# Altium schematic sheet Sheet_1_2022-11-05.schdoc
size 786 x 797 mm
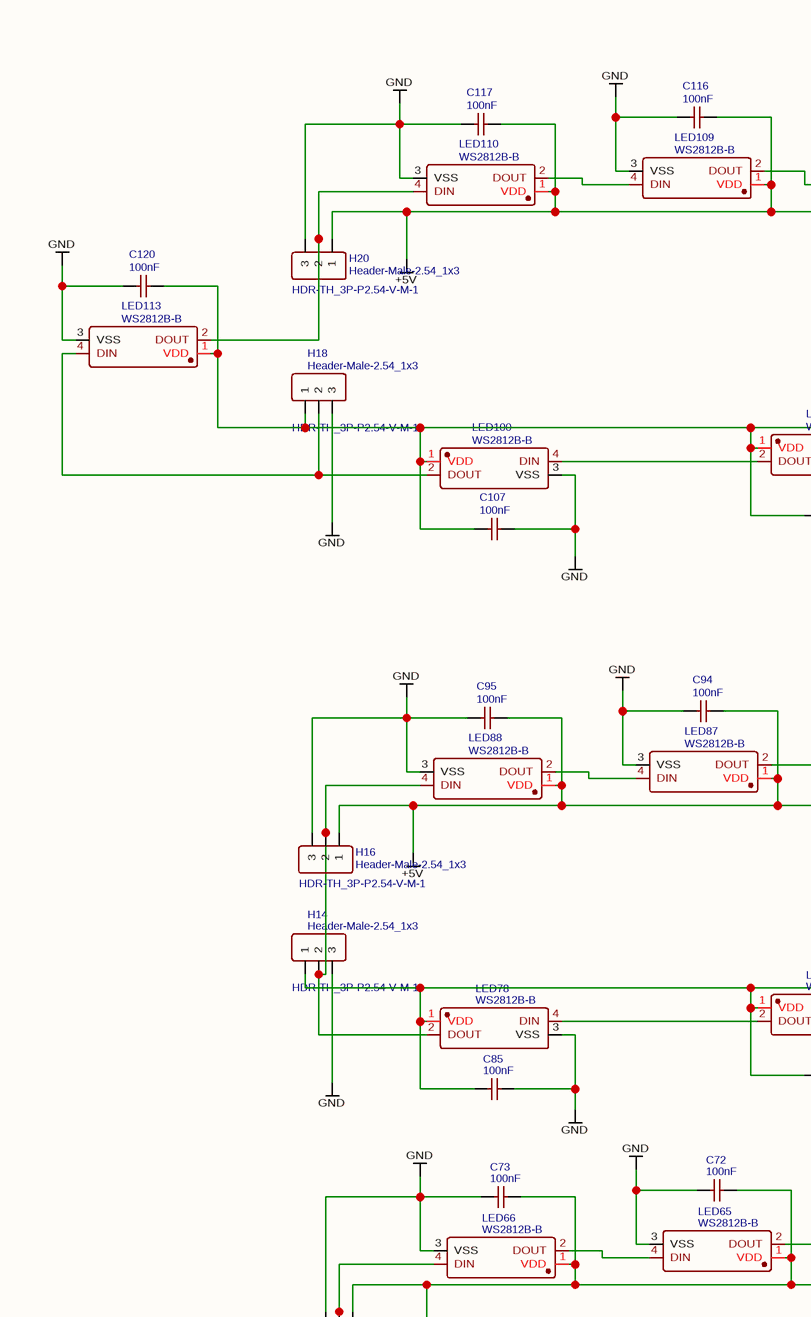
[diagram p0: Sheet_1_2022-11-05.schdoc, top left]
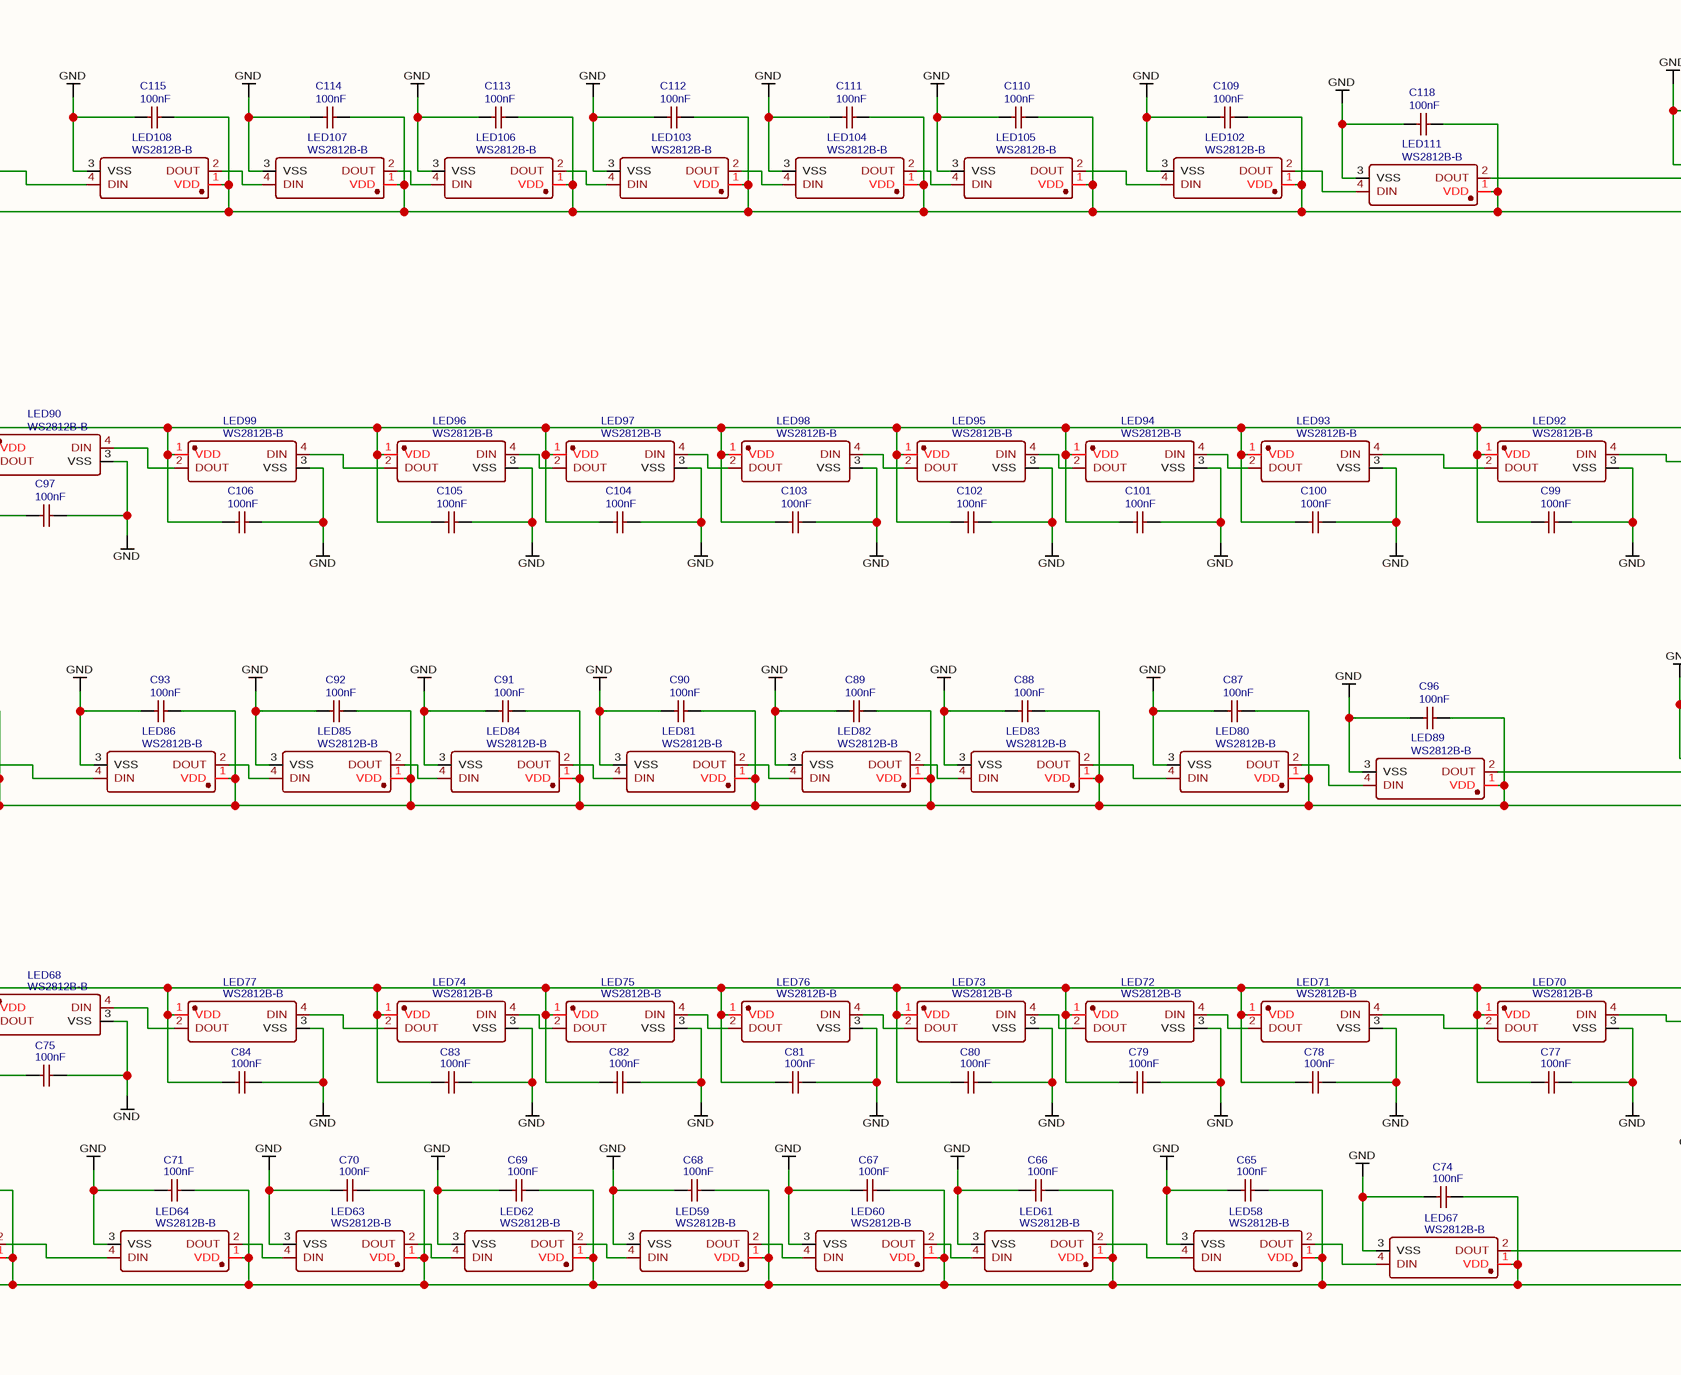
[diagram p1: Sheet_1_2022-11-05.schdoc, top middle]
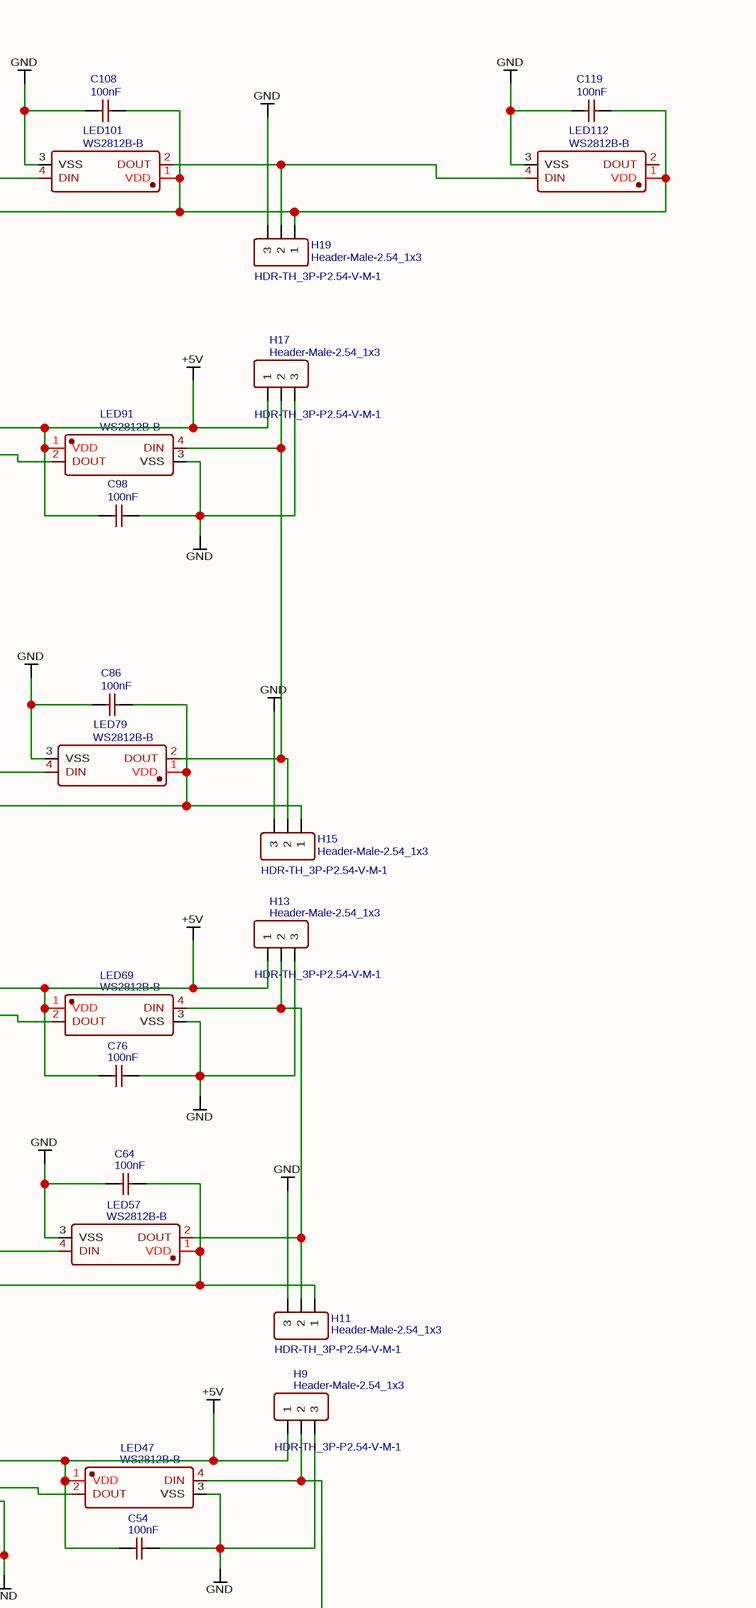
[diagram p2: Sheet_1_2022-11-05.schdoc, top right]
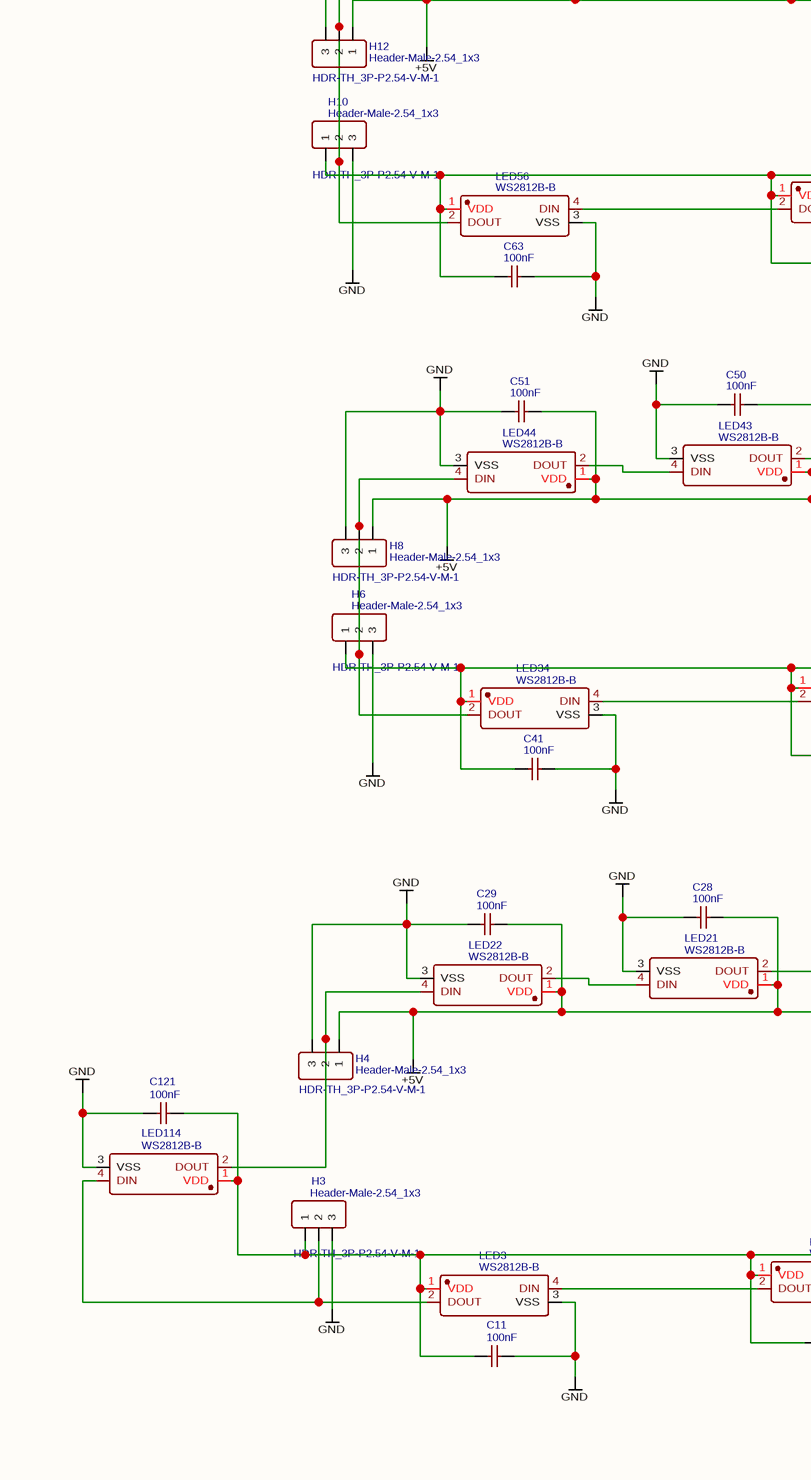
[diagram p3: Sheet_1_2022-11-05.schdoc, centre left]
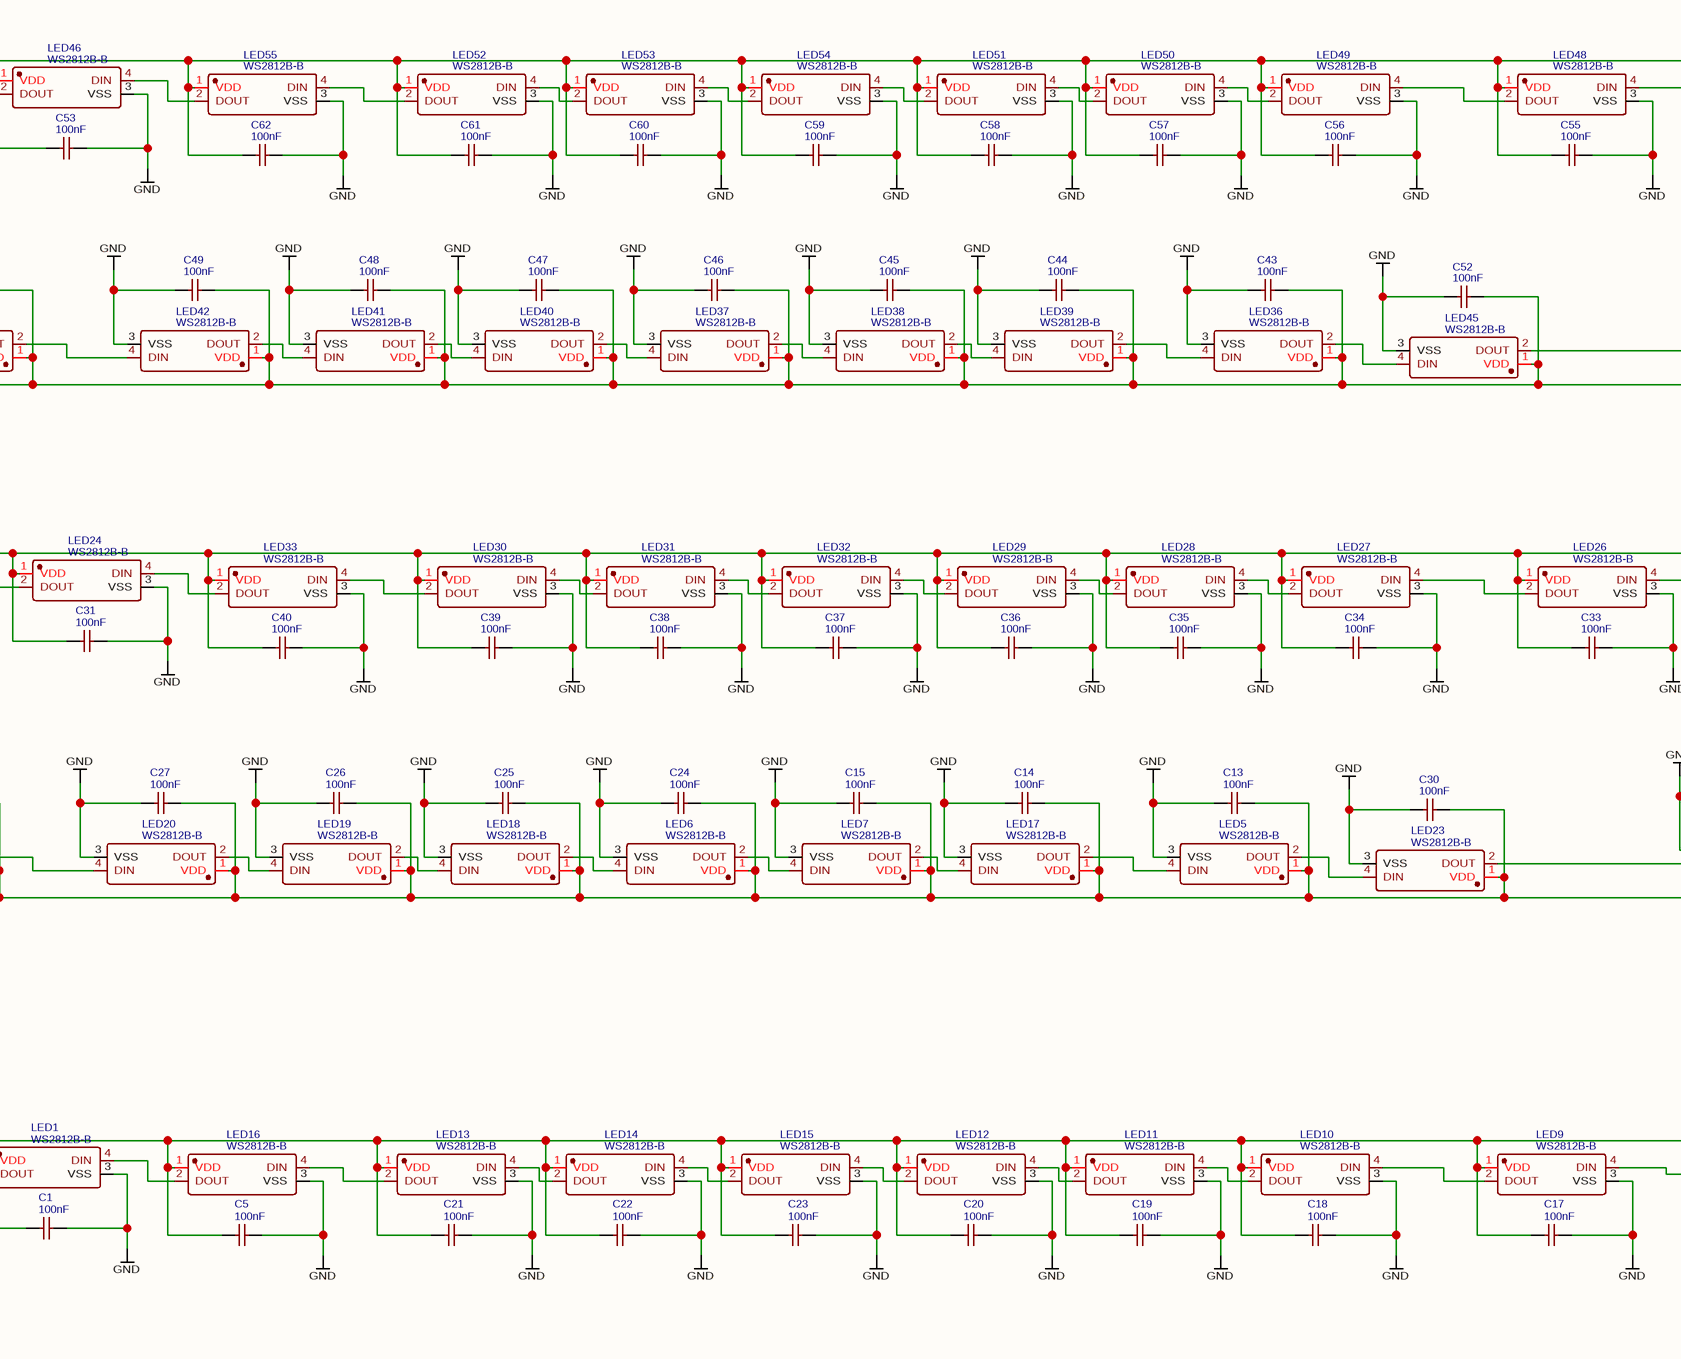
[diagram p4: Sheet_1_2022-11-05.schdoc, centre middle]
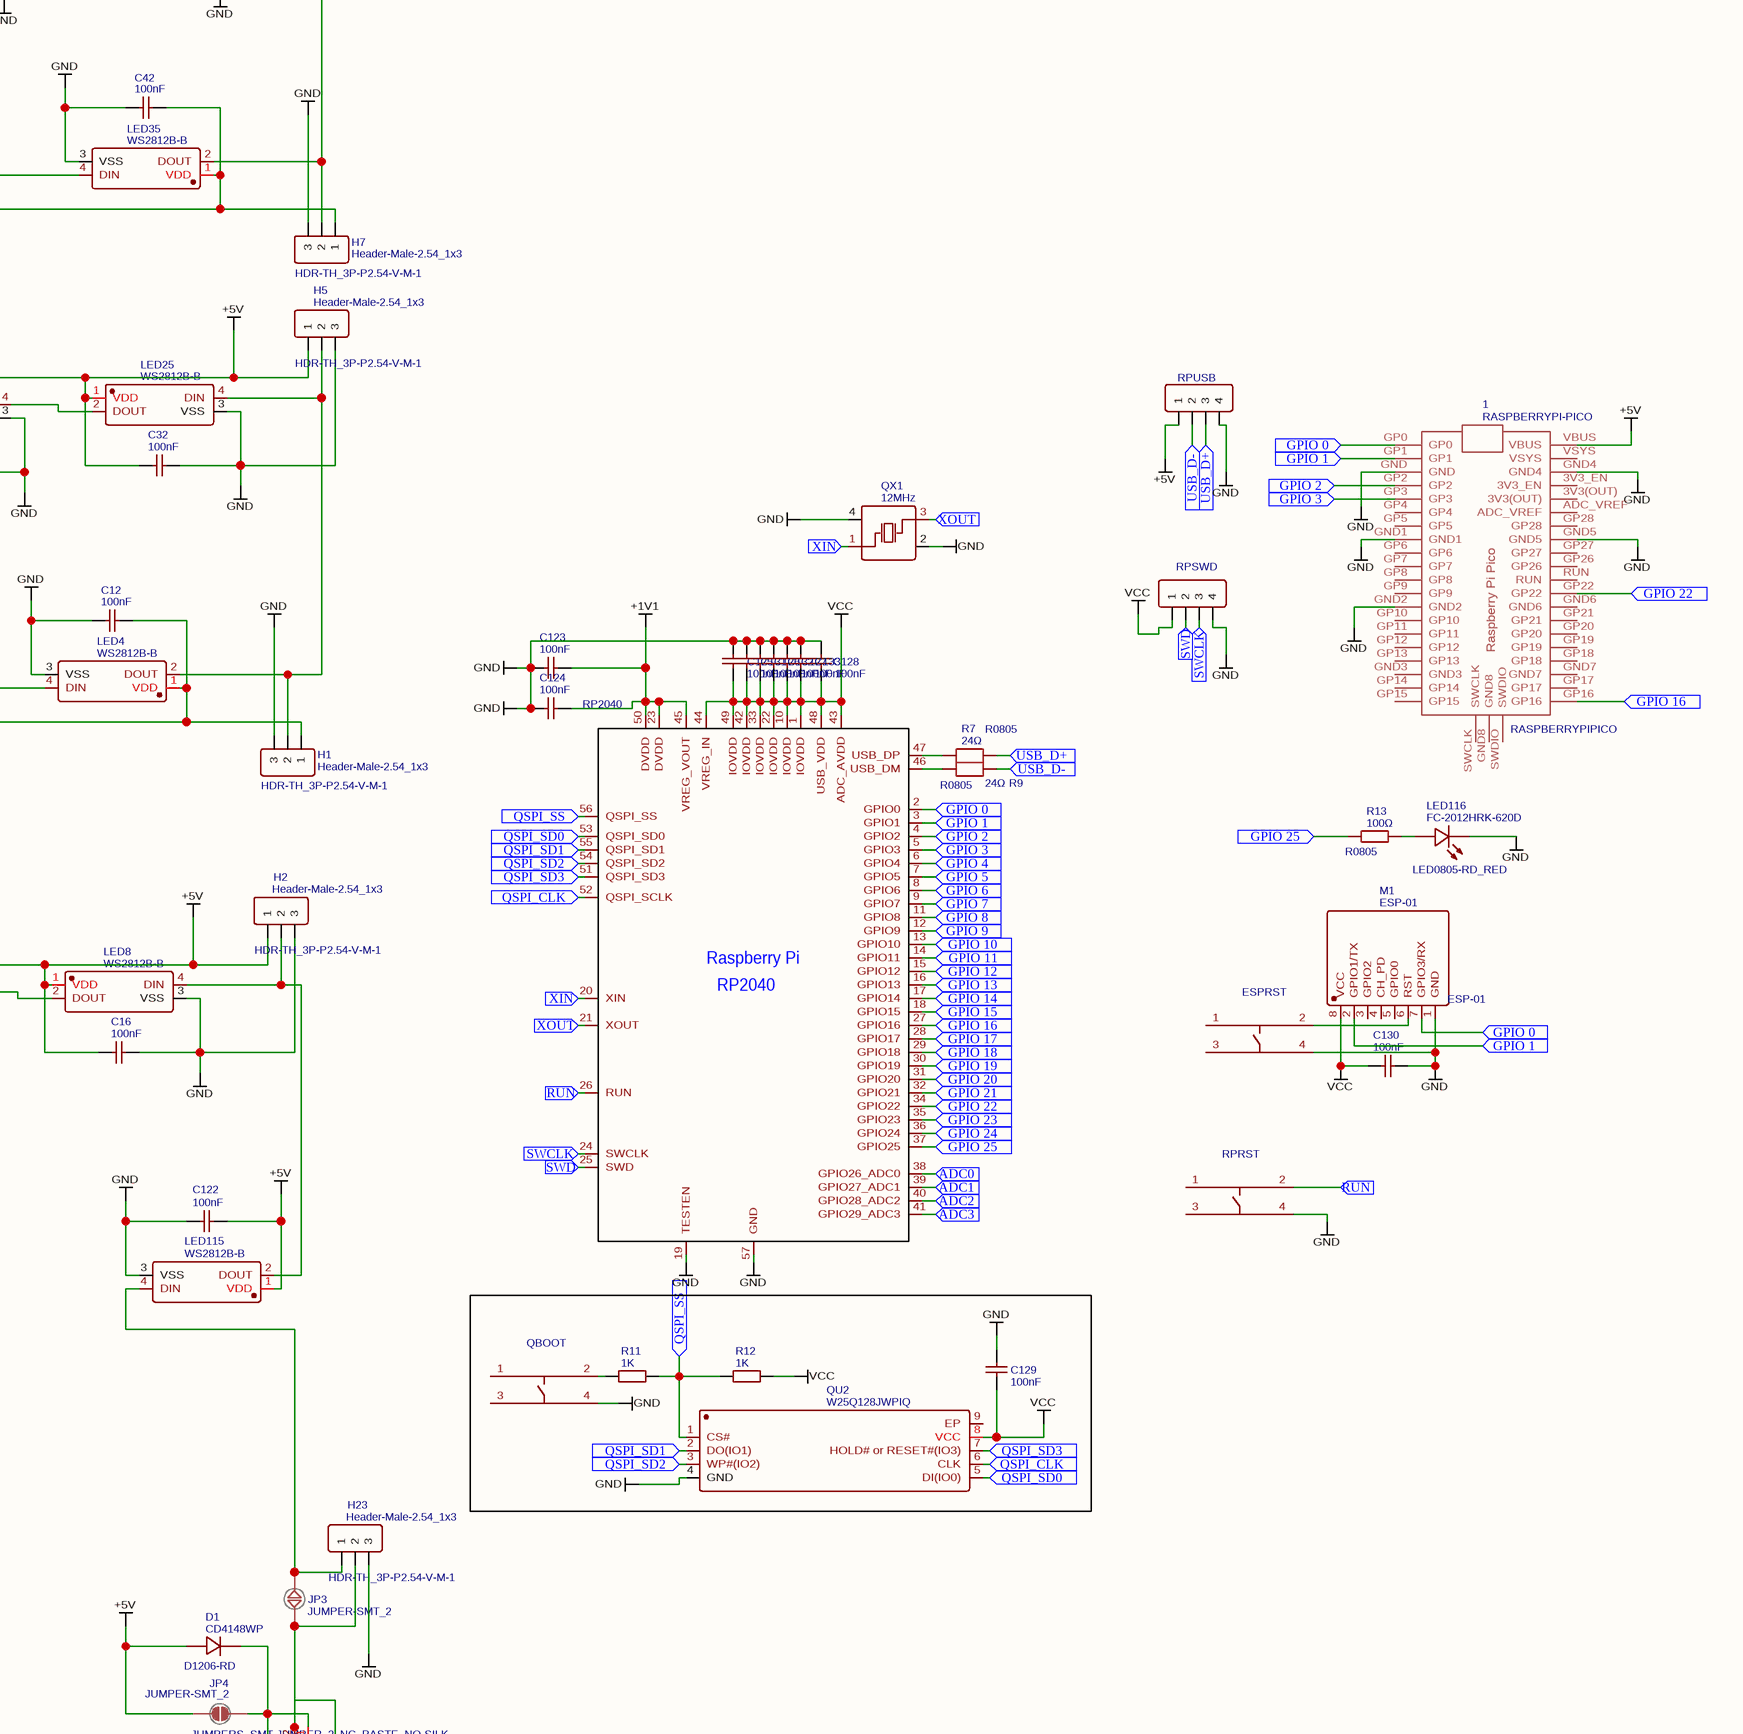
[diagram p5: Sheet_1_2022-11-05.schdoc, centre right]
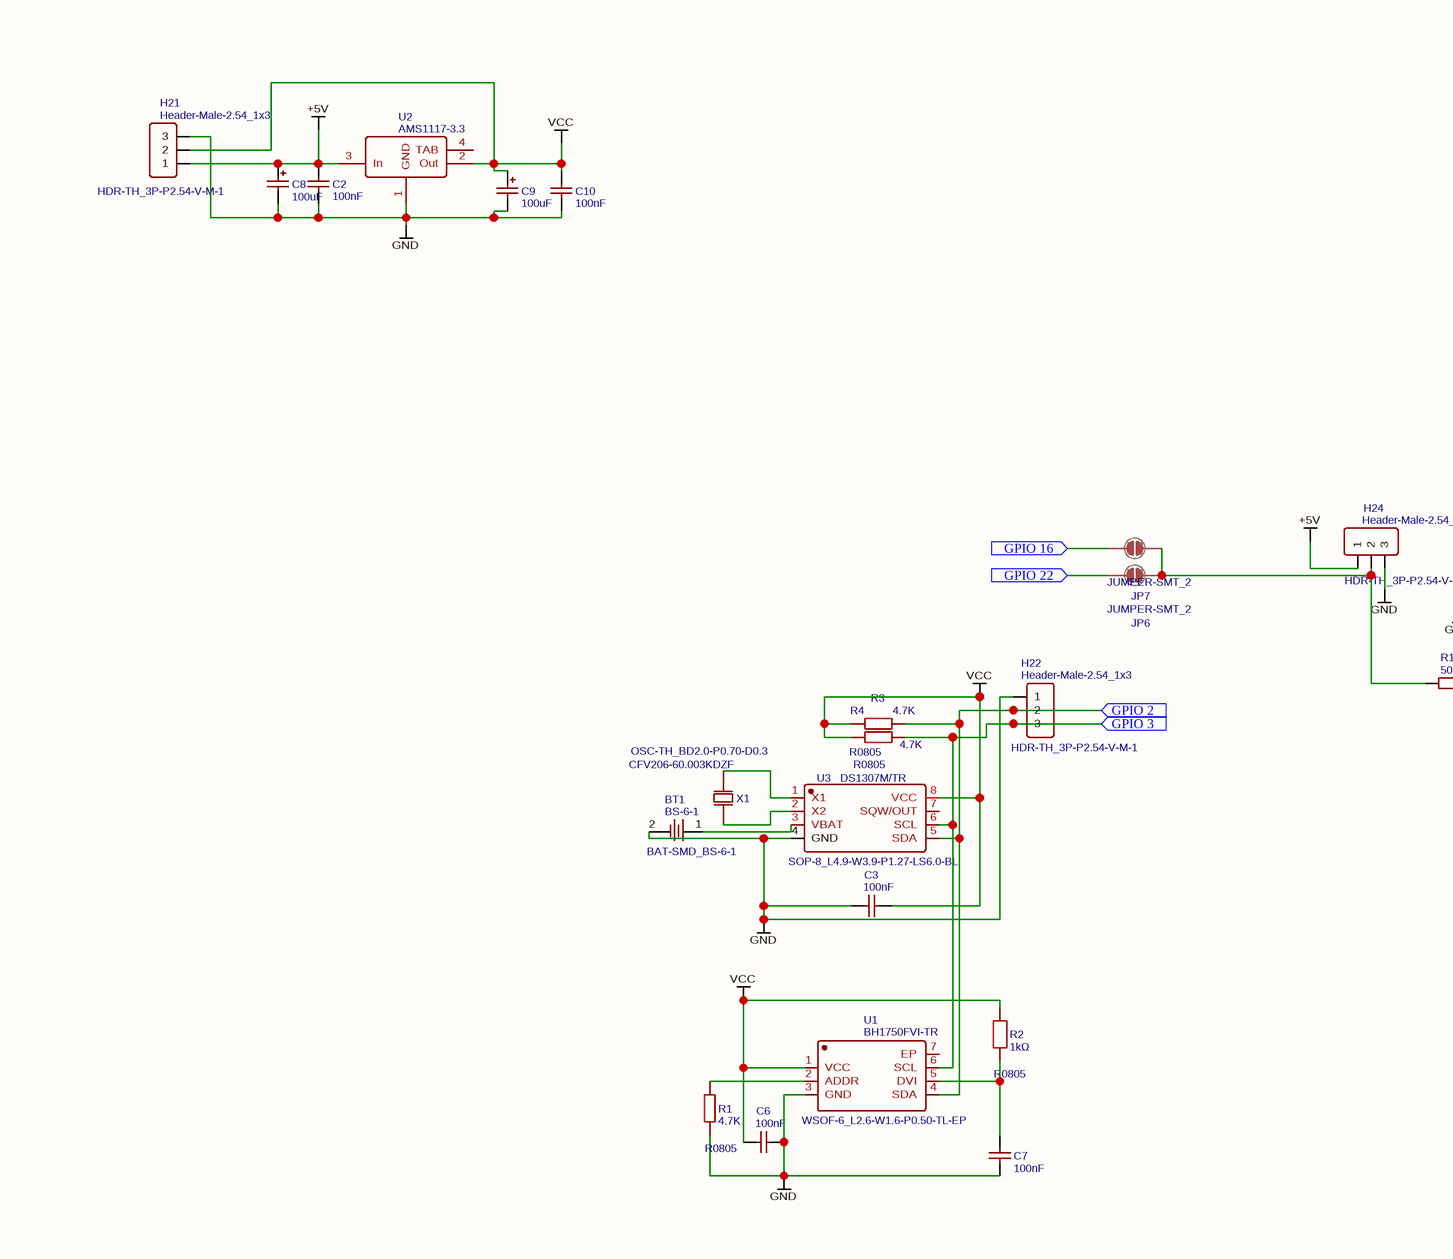
[diagram p6: Sheet_1_2022-11-05.schdoc, bottom middle]
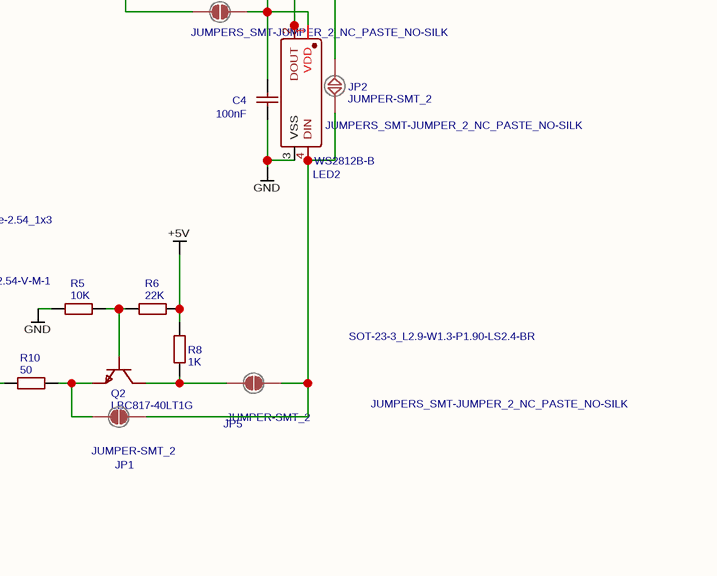
[diagram p7: Sheet_1_2022-11-05.schdoc, bottom right]

## Parts
1  RASPBERRYPI-PICO  [RASPBERRYPIPICO]
BT1  BS-6-1  [BAT-SMD_BS-6-1]
C1  100nF  [0805]
C2  100nF  [0805]
C3  100nF  [0805]
C4  100nF  [0805]
C5  100nF  [0805]
C6  100nF  [0805]
C7  100nF  [0805]
C8  100uF  [CAP-SMD_L3.5-W2.8]
C9  100uF  [CAP-SMD_L3.5-W2.8]
C10  100nF  [0805]
C11  100nF  [0805]
C12  100nF  [0805]
C13  100nF  [0805]
C14  100nF  [0805]
C15  100nF  [0805]
C16  100nF  [0805]
C17  100nF  [0805]
C18  100nF  [0805]
C19  100nF  [0805]
C20  100nF  [0805]
C21  100nF  [0805]
C22  100nF  [0805]
C23  100nF  [0805]
C24  100nF  [0805]
C25  100nF  [0805]
C26  100nF  [0805]
C27  100nF  [0805]
C28  100nF  [0805]
C29  100nF  [0805]
C30  100nF  [0805]
C31  100nF  [0805]
C32  100nF  [0805]
C33  100nF  [0805]
C34  100nF  [0805]
C35  100nF  [0805]
C36  100nF  [0805]
C37  100nF  [0805]
C38  100nF  [0805]
C39  100nF  [0805]
C40  100nF  [0805]
C41  100nF  [0805]
C42  100nF  [0805]
C43  100nF  [0805]
C44  100nF  [0805]
C45  100nF  [0805]
C46  100nF  [0805]
C47  100nF  [0805]
C48  100nF  [0805]
C49  100nF  [0805]
C50  100nF  [0805]
C51  100nF  [0805]
C52  100nF  [0805]
C53  100nF  [0805]
C54  100nF  [0805]
C55  100nF  [0805]
C56  100nF  [0805]
C57  100nF  [0805]
C58  100nF  [0805]
C59  100nF  [0805]
C60  100nF  [0805]
C61  100nF  [0805]
C62  100nF  [0805]
C63  100nF  [0805]
C64  100nF  [0805]
C65  100nF  [0805]
C66  100nF  [0805]
C67  100nF  [0805]
C68  100nF  [0805]
C69  100nF  [0805]
C70  100nF  [0805]
C71  100nF  [0805]
C72  100nF  [0805]
C73  100nF  [0805]
C74  100nF  [0805]
C75  100nF  [0805]
C76  100nF  [0805]
C77  100nF  [0805]
C78  100nF  [0805]
C79  100nF  [0805]
C80  100nF  [0805]
C81  100nF  [0805]
C82  100nF  [0805]
C83  100nF  [0805]
C84  100nF  [0805]
C85  100nF  [0805]
C86  100nF  [0805]
C87  100nF  [0805]
C88  100nF  [0805]
C89  100nF  [0805]
C90  100nF  [0805]
C91  100nF  [0805]
C92  100nF  [0805]
C93  100nF  [0805]
C94  100nF  [0805]
C95  100nF  [0805]
C96  100nF  [0805]
C97  100nF  [0805]
C98  100nF  [0805]
C99  100nF  [0805]
C100  100nF  [0805]
C101  100nF  [0805]
C102  100nF  [0805]
C103  100nF  [0805]
C104  100nF  [0805]
C105  100nF  [0805]
C106  100nF  [0805]
C107  100nF  [0805]
C108  100nF  [0805]
C109  100nF  [0805]
C110  100nF  [0805]
C111  100nF  [0805]
C112  100nF  [0805]
C113  100nF  [0805]
C114  100nF  [0805]
C115  100nF  [0805]
C116  100nF  [0805]
C117  100nF  [0805]
C118  100nF  [0805]
C119  100nF  [0805]
C120  100nF  [0805]
C121  100nF  [0805]
C122  100nF  [0805]
C123  100nF  [0805]
C124  100nF  [0805]
C125  100nF  [0805]
C126  100nF  [0805]
C127  100nF  [0805]
C128  100nF  [0805]
C129  100nF  [0805]
C130  100nF  [0805]
C131  100nF  [0805]
C132  100nF  [0805]
C133  100nF  [0805]
D1  CD4148WP  [D1206-RD]
ESPRST  PTS810SJM250SMTRLFS  [KEY-SMD_4P-L4.2-W3.2-P2.20-LS4.6]  (value not drawn)
H1  Header-Male-2.54_1x3  [HDR-TH_3P-P2.54-V-M-1]
H2  Header-Male-2.54_1x3  [HDR-TH_3P-P2.54-V-M-1]
H3  Header-Male-2.54_1x3  [HDR-TH_3P-P2.54-V-M-1]
H4  Header-Male-2.54_1x3  [HDR-TH_3P-P2.54-V-M-1]
H5  Header-Male-2.54_1x3  [HDR-TH_3P-P2.54-V-M-1]
H6  Header-Male-2.54_1x3  [HDR-TH_3P-P2.54-V-M-1]
H7  Header-Male-2.54_1x3  [HDR-TH_3P-P2.54-V-M-1]
H8  Header-Male-2.54_1x3  [HDR-TH_3P-P2.54-V-M-1]
H9  Header-Male-2.54_1x3  [HDR-TH_3P-P2.54-V-M-1]
H10  Header-Male-2.54_1x3  [HDR-TH_3P-P2.54-V-M-1]
H11  Header-Male-2.54_1x3  [HDR-TH_3P-P2.54-V-M-1]
H12  Header-Male-2.54_1x3  [HDR-TH_3P-P2.54-V-M-1]
H13  Header-Male-2.54_1x3  [HDR-TH_3P-P2.54-V-M-1]
H14  Header-Male-2.54_1x3  [HDR-TH_3P-P2.54-V-M-1]
H15  Header-Male-2.54_1x3  [HDR-TH_3P-P2.54-V-M-1]
H16  Header-Male-2.54_1x3  [HDR-TH_3P-P2.54-V-M-1]
H17  Header-Male-2.54_1x3  [HDR-TH_3P-P2.54-V-M-1]
H18  Header-Male-2.54_1x3  [HDR-TH_3P-P2.54-V-M-1]
H19  Header-Male-2.54_1x3  [HDR-TH_3P-P2.54-V-M-1]
H20  Header-Male-2.54_1x3  [HDR-TH_3P-P2.54-V-M-1]
H21  Header-Male-2.54_1x3  [HDR-TH_3P-P2.54-V-M-1]
H22  Header-Male-2.54_1x3  [HDR-TH_3P-P2.54-V-M-1]
H23  Header-Male-2.54_1x3  [HDR-TH_3P-P2.54-V-M-1]
H24  Header-Male-2.54_1x3  [HDR-TH_3P-P2.54-V-M-1]
JP1  JUMPER-SMT_2  [JUMPERS_SMT-JUMPER_2_NC_PASTE_NO-SILK]
JP2  JUMPER-SMT_2  [JUMPERS_SMT-JUMPER_2_NC_PASTE_NO-SILK]
JP3  JUMPER-SMT_2  [JUMPERS_SMT-JUMPER_2_NC_PASTE_NO-SILK]
JP4  JUMPER-SMT_2  [JUMPERS_SMT-JUMPER_2_NC_PASTE_NO-SILK]
JP5  JUMPER-SMT_2  [JUMPERS_SMT-JUMPER_2_NC_PASTE_NO-SILK]
JP6  JUMPER-SMT_2  [JUMPERS_SMT-JUMPER_2_NC_PASTE_NO-SILK]
JP7  JUMPER-SMT_2  [JUMPERS_SMT-JUMPER_2_NC_PASTE_NO-SILK]
LED1  WS2812B-B  [LED-5050_4P]
LED2  WS2812B-B  [LED-5050_4P]
LED3  WS2812B-B  [LED-5050_4P]
LED4  WS2812B-B  [LED-5050_4P]
LED5  WS2812B-B  [LED-5050_4P]
LED6  WS2812B-B  [LED-5050_4P]
LED7  WS2812B-B  [LED-5050_4P]
LED8  WS2812B-B  [LED-5050_4P]
LED9  WS2812B-B  [LED-5050_4P]
LED10  WS2812B-B  [LED-5050_4P]
LED11  WS2812B-B  [LED-5050_4P]
LED12  WS2812B-B  [LED-5050_4P]
LED13  WS2812B-B  [LED-5050_4P]
LED14  WS2812B-B  [LED-5050_4P]
LED15  WS2812B-B  [LED-5050_4P]
LED16  WS2812B-B  [LED-5050_4P]
LED17  WS2812B-B  [LED-5050_4P]
LED18  WS2812B-B  [LED-5050_4P]
LED19  WS2812B-B  [LED-5050_4P]
LED20  WS2812B-B  [LED-5050_4P]
LED21  WS2812B-B  [LED-5050_4P]
LED22  WS2812B-B  [LED-5050_4P]
LED23  WS2812B-B  [LED-5050_4P]
LED24  WS2812B-B  [LED-5050_4P]
LED25  WS2812B-B  [LED-5050_4P]
LED26  WS2812B-B  [LED-5050_4P]
LED27  WS2812B-B  [LED-5050_4P]
LED28  WS2812B-B  [LED-5050_4P]
LED29  WS2812B-B  [LED-5050_4P]
LED30  WS2812B-B  [LED-5050_4P]
LED31  WS2812B-B  [LED-5050_4P]
LED32  WS2812B-B  [LED-5050_4P]
LED33  WS2812B-B  [LED-5050_4P]
LED34  WS2812B-B  [LED-5050_4P]
LED35  WS2812B-B  [LED-5050_4P]
LED36  WS2812B-B  [LED-5050_4P]
LED37  WS2812B-B  [LED-5050_4P]
LED38  WS2812B-B  [LED-5050_4P]
LED39  WS2812B-B  [LED-5050_4P]
LED40  WS2812B-B  [LED-5050_4P]
LED41  WS2812B-B  [LED-5050_4P]
LED42  WS2812B-B  [LED-5050_4P]
LED43  WS2812B-B  [LED-5050_4P]
LED44  WS2812B-B  [LED-5050_4P]
LED45  WS2812B-B  [LED-5050_4P]
LED46  WS2812B-B  [LED-5050_4P]
LED47  WS2812B-B  [LED-5050_4P]
LED48  WS2812B-B  [LED-5050_4P]
LED49  WS2812B-B  [LED-5050_4P]
LED50  WS2812B-B  [LED-5050_4P]
LED51  WS2812B-B  [LED-5050_4P]
LED52  WS2812B-B  [LED-5050_4P]
LED53  WS2812B-B  [LED-5050_4P]
LED54  WS2812B-B  [LED-5050_4P]
LED55  WS2812B-B  [LED-5050_4P]
LED56  WS2812B-B  [LED-5050_4P]
LED57  WS2812B-B  [LED-5050_4P]
LED58  WS2812B-B  [LED-5050_4P]
LED59  WS2812B-B  [LED-5050_4P]
LED60  WS2812B-B  [LED-5050_4P]
LED61  WS2812B-B  [LED-5050_4P]
LED62  WS2812B-B  [LED-5050_4P]
LED63  WS2812B-B  [LED-5050_4P]
LED64  WS2812B-B  [LED-5050_4P]
LED65  WS2812B-B  [LED-5050_4P]
LED66  WS2812B-B  [LED-5050_4P]
LED67  WS2812B-B  [LED-5050_4P]
LED68  WS2812B-B  [LED-5050_4P]
LED69  WS2812B-B  [LED-5050_4P]
LED70  WS2812B-B  [LED-5050_4P]
LED71  WS2812B-B  [LED-5050_4P]
LED72  WS2812B-B  [LED-5050_4P]
LED73  WS2812B-B  [LED-5050_4P]
LED74  WS2812B-B  [LED-5050_4P]
LED75  WS2812B-B  [LED-5050_4P]
LED76  WS2812B-B  [LED-5050_4P]
LED77  WS2812B-B  [LED-5050_4P]
LED78  WS2812B-B  [LED-5050_4P]
LED79  WS2812B-B  [LED-5050_4P]
LED80  WS2812B-B  [LED-5050_4P]
LED81  WS2812B-B  [LED-5050_4P]
LED82  WS2812B-B  [LED-5050_4P]
LED83  WS2812B-B  [LED-5050_4P]
LED84  WS2812B-B  [LED-5050_4P]
LED85  WS2812B-B  [LED-5050_4P]
LED86  WS2812B-B  [LED-5050_4P]
LED87  WS2812B-B  [LED-5050_4P]
LED88  WS2812B-B  [LED-5050_4P]
LED89  WS2812B-B  [LED-5050_4P]
LED90  WS2812B-B  [LED-5050_4P]
LED91  WS2812B-B  [LED-5050_4P]
LED92  WS2812B-B  [LED-5050_4P]
LED93  WS2812B-B  [LED-5050_4P]
LED94  WS2812B-B  [LED-5050_4P]
LED95  WS2812B-B  [LED-5050_4P]
LED96  WS2812B-B  [LED-5050_4P]
LED97  WS2812B-B  [LED-5050_4P]
LED98  WS2812B-B  [LED-5050_4P]
LED99  WS2812B-B  [LED-5050_4P]
LED100  WS2812B-B  [LED-5050_4P]
LED101  WS2812B-B  [LED-5050_4P]
LED102  WS2812B-B  [LED-5050_4P]
LED103  WS2812B-B  [LED-5050_4P]
LED104  WS2812B-B  [LED-5050_4P]
LED105  WS2812B-B  [LED-5050_4P]
LED106  WS2812B-B  [LED-5050_4P]
LED107  WS2812B-B  [LED-5050_4P]
LED108  WS2812B-B  [LED-5050_4P]
LED109  WS2812B-B  [LED-5050_4P]
LED110  WS2812B-B  [LED-5050_4P]
LED111  WS2812B-B  [LED-5050_4P]
LED112  WS2812B-B  [LED-5050_4P]
LED113  WS2812B-B  [LED-5050_4P]
LED114  WS2812B-B  [LED-5050_4P]
LED115  WS2812B-B  [LED-5050_4P]
LED116  FC-2012HRK-620D  [LED0805-RD_RED]
M1  ESP-01  [ESP-01]
Q2  LBC817-40LT1G  [SOT-23-3_L2.9-W1.3-P1.90-LS2.4-BR]
QBOOT  PTS810SJM250SMTRLFS  [KEY-SMD_4P-L4.2-W3.2-P2.20-LS4.6]  (value not drawn)
QU1  RP2040  [LQFN-56_L7.0-W7.0-P0.4-EP]
QU2  W25Q128JWPIQ  [WSON-8_L6.0-W5.0-P1.27-BL-EP]
QX1  12MHz  [CRYSTAL-SMD_4P-L3.2-W2.5-BL]
R1  4.7K  [R0805]
R2  1kΩ  [R0805]
R3  4.7K  [R0805]
R4  4.7K  [R0805]
R5  10K  [0805]
R6  22K  [0805]
R7  24Ω  [R0805]
R8  1K  [0805]
R9  24Ω  [R0805]
R10  50  [0805]
R11  1K  [0805]
R12  1K  [0805]
R13  100Ω  [R0805]
RPRST  PTS810SJM250SMTRLFS  [KEY-SMD_4P-L4.2-W3.2-P2.20-LS4.6]  (value not drawn)
RPSWD  HDR-M-2.54_1x4  [HDR-M-2.54_1X4]  (value not drawn)
RPUSB  HDR-M-2.54_1x4  [HDR-M-2.54_1X4]  (value not drawn)
U1  BH1750FVI-TR  [WSOF-6_L2.6-W1.6-P0.50-TL-EP]
U2  AMS1117-3.3  [SOT-223_L6.5-W3.5-P2.30-LS7.0-BR]
U3  DS1307M/TR  [SOP-8_L4.9-W3.9-P1.27-LS6.0-BL]
X1  CFV206-60.003KDZF  [OSC-TH_BD2.0-P0.70-D0.3]

## Ports
ADC0 (in), ADC1 (in), ADC2 (in), ADC3 (in), GPIO 0 (in), GPIO 1 (in), GPIO 2 (in), GPIO 3 (in), GPIO 4 (in), GPIO 5 (in), GPIO 6 (in), GPIO 7 (in), GPIO 8 (in), GPIO 9 (in), GPIO 10 (in), GPIO 11 (in), GPIO 12 (in), GPIO 13 (in), GPIO 14 (in), GPIO 15 (in), GPIO 16 (in), GPIO 17 (in), GPIO 18 (in), GPIO 19 (in), GPIO 20 (in), GPIO 21 (in), GPIO 22 (in), GPIO 23 (in), GPIO 24 (in), GPIO 25 (in), QSPI_CLK (in), QSPI_SD0 (in), QSPI_SD1 (in), QSPI_SD2 (in), QSPI_SD3 (in), QSPI_SS (in), RUN (in), SWCLK (in), SWD (in), USB_D+ (in), USB_D- (in), XIN (in), XOUT (in)

## Nets
+1V1: C123.1 C124.1 QU1.23(DVDD) QU1.45(VREG_VOUT) QU1.50(DVDD)
+5V: 1.VBUS C1.1 C2.2 C5.1 C8.1 C11.1 C12.1 C13.1 C14.1 C15.1 C16.1 C17.1 C18.1 C19.1 C20.1 C21.1 C22.1 C23.1 C24.1 C25.1 C26.1 C27.1 C28.1 C29.1 C30.1 C31.1 C32.1 C33.1 C34.1 C35.1 C36.1 C37.1 C38.1 C39.1 C40.1 C41.1 C42.1 C43.1 C44.1 C45.1 C46.1 C47.1 C48.1 C49.1 C50.1 C51.1 C52.1 C53.1 C54.1 C55.1 C56.1 C57.1 C58.1 C59.1 C60.1 C61.1 C62.1 C63.1 C64.1 C65.1 C66.1 C67.1 C68.1 C69.1 C70.1 C71.1 C72.1 C73.1 C74.1 C75.1 C76.1 C77.1 C78.1 C79.1 C80.1 C81.1 C82.1 C83.1 C84.1 C85.1 C86.1 C87.1 C88.1 C89.1 C90.1 C91.1 C92.1 C93.1 C94.1 C95.1 C96.1 C97.1 C98.1 C99.1 C100.1 C101.1 C102.1 C103.1 C104.1 C105.1 C106.1 C107.1 C108.1 C109.1 C110.1 C111.1 C112.1 C113.1 C114.1 C115.1 C116.1 C117.1 C118.1 C119.1 C120.1 C121.1 C122.1 D1.2(A) H1.1 H2.1 H3.1 H4.1 H5.1 H6.1 H7.1 H8.1 H9.1 H10.1 H11.1 H12.1 H13.1 H14.1 H15.1 H16.1 H17.1 H18.1 H19.1 H20.1 H21.1 H24.1 JP4.1 LED1.1(VDD) LED3.1(VDD) LED4.1(VDD) LED5.1(VDD) LED6.1(VDD) LED7.1(VDD) LED8.1(VDD) LED9.1(VDD) LED10.1(VDD) LED11.1(VDD) LED12.1(VDD) LED13.1(VDD) LED14.1(VDD) LED15.1(VDD) LED16.1(VDD) LED17.1(VDD) LED18.1(VDD) LED19.1(VDD) LED20.1(VDD) LED21.1(VDD) LED22.1(VDD) LED23.1(VDD) LED24.1(VDD) LED25.1(VDD) LED26.1(VDD) LED27.1(VDD) LED28.1(VDD) LED29.1(VDD) LED30.1(VDD) LED31.1(VDD) LED32.1(VDD) LED33.1(VDD) LED34.1(VDD) LED35.1(VDD) LED36.1(VDD) LED37.1(VDD) LED38.1(VDD) LED39.1(VDD) LED40.1(VDD) LED41.1(VDD) LED42.1(VDD) LED43.1(VDD) LED44.1(VDD) LED45.1(VDD) LED46.1(VDD) LED47.1(VDD) LED48.1(VDD) LED49.1(VDD) LED50.1(VDD) LED51.1(VDD) LED52.1(VDD) LED53.1(VDD) LED54.1(VDD) LED55.1(VDD) LED56.1(VDD) LED57.1(VDD) LED58.1(VDD) LED59.1(VDD) LED60.1(VDD) LED61.1(VDD) LED62.1(VDD) LED63.1(VDD) LED64.1(VDD) LED65.1(VDD) LED66.1(VDD) LED67.1(VDD) LED68.1(VDD) LED69.1(VDD) LED70.1(VDD) LED71.1(VDD) LED72.1(VDD) LED73.1(VDD) LED74.1(VDD) LED75.1(VDD) LED76.1(VDD) LED77.1(VDD) LED78.1(VDD) LED79.1(VDD) LED80.1(VDD) LED81.1(VDD) LED82.1(VDD) LED83.1(VDD) LED84.1(VDD) LED85.1(VDD) LED86.1(VDD) LED87.1(VDD) LED88.1(VDD) LED89.1(VDD) LED90.1(VDD) LED91.1(VDD) LED92.1(VDD) LED93.1(VDD) LED94.1(VDD) LED95.1(VDD) LED96.1(VDD) LED97.1(VDD) LED98.1(VDD) LED99.1(VDD) LED100.1(VDD) LED101.1(VDD) LED102.1(VDD) LED103.1(VDD) LED104.1(VDD) LED105.1(VDD) LED106.1(VDD) LED107.1(VDD) LED108.1(VDD) LED109.1(VDD) LED110.1(VDD) LED111.1(VDD) LED112.1(VDD) LED113.1(VDD) LED114.1(VDD) LED115.1(VDD) R6.2 R8.2 RPUSB.1 U2.3(In)
GND: 1.GND 1.GND1 1.GND2 1.GND4 1.GND5 BT1.2 C1.2 C2.1 C3.2 C4.2 C5.2 C6.1 C7.2 C8.2 C9.2 C10.1 C11.2 C12.2 C13.2 C14.2 C15.2 C16.2 C17.2 C18.2 C19.2 C20.2 C21.2 C22.2 C23.2 C24.2 C25.2 C26.2 C27.2 C28.2 C29.2 C30.2 C31.2 C32.2 C33.2 C34.2 C35.2 C36.2 C37.2 C38.2 C39.2 C40.2 C41.2 C42.2 C43.2 C44.2 C45.2 C46.2 C47.2 C48.2 C49.2 C50.2 C51.2 C52.2 C53.2 C54.2 C55.2 C56.2 C57.2 C58.2 C59.2 C60.2 C61.2 C62.2 C63.2 C64.2 C65.2 C66.2 C67.2 C68.2 C69.2 C70.2 C71.2 C72.2 C73.2 C74.2 C75.2 C76.2 C77.2 C78.2 C79.2 C80.2 C81.2 C82.2 C83.2 C84.2 C85.2 C86.2 C87.2 C88.2 C89.2 C90.2 C91.2 C92.2 C93.2 C94.2 C95.2 C96.2 C97.2 C98.2 C99.2 C100.2 C101.2 C102.2 C103.2 C104.2 C105.2 C106.2 C107.2 C108.2 C109.2 C110.2 C111.2 C112.2 C113.2 C114.2 C115.2 C116.2 C117.2 C118.2 C119.2 C120.2 C121.2 C122.2 C123.2 C124.2 C125.1 C126.1 C127.1 C128.1 C129.1 C130.2 C131.1 C132.1 C133.1 ESPRST.4 H1.3 H2.3 H3.3 H4.3 H5.3 H6.3 H7.3 H8.3 H9.3 H10.3 H11.3 H12.3 H13.3 H14.3 H15.3 H16.3 H17.3 H18.3 H19.3 H20.3 H21.3 H22.1 H23.3 H24.3 LED1.3(VSS) LED2.3(VSS) LED3.3(VSS) LED4.3(VSS) LED5.3(VSS) LED6.3(VSS) LED7.3(VSS) LED8.3(VSS) LED9.3(VSS) LED10.3(VSS) LED11.3(VSS) LED12.3(VSS) LED13.3(VSS) LED14.3(VSS) LED15.3(VSS) LED16.3(VSS) LED17.3(VSS) LED18.3(VSS) LED19.3(VSS) LED20.3(VSS) LED21.3(VSS) LED22.3(VSS) LED23.3(VSS) LED24.3(VSS) LED25.3(VSS) LED26.3(VSS) LED27.3(VSS) LED28.3(VSS) LED29.3(VSS) LED30.3(VSS) LED31.3(VSS) LED32.3(VSS) LED33.3(VSS) LED34.3(VSS) LED35.3(VSS) LED36.3(VSS) LED37.3(VSS) LED38.3(VSS) LED39.3(VSS) LED40.3(VSS) LED41.3(VSS) LED42.3(VSS) LED43.3(VSS) LED44.3(VSS) LED45.3(VSS) LED46.3(VSS) LED47.3(VSS) LED48.3(VSS) LED49.3(VSS) LED50.3(VSS) LED51.3(VSS) LED52.3(VSS) LED53.3(VSS) LED54.3(VSS) LED55.3(VSS) LED56.3(VSS) LED57.3(VSS) LED58.3(VSS) LED59.3(VSS) LED60.3(VSS) LED61.3(VSS) LED62.3(VSS) LED63.3(VSS) LED64.3(VSS) LED65.3(VSS) LED66.3(VSS) LED67.3(VSS) LED68.3(VSS) LED69.3(VSS) LED70.3(VSS) LED71.3(VSS) LED72.3(VSS) LED73.3(VSS) LED74.3(VSS) LED75.3(VSS) LED76.3(VSS) LED77.3(VSS) LED78.3(VSS) LED79.3(VSS) LED80.3(VSS) LED81.3(VSS) LED82.3(VSS) LED83.3(VSS) LED84.3(VSS) LED85.3(VSS) LED86.3(VSS) LED87.3(VSS) LED88.3(VSS) LED89.3(VSS) LED90.3(VSS) LED91.3(VSS) LED92.3(VSS) LED93.3(VSS) LED94.3(VSS) LED95.3(VSS) LED96.3(VSS) LED97.3(VSS) LED98.3(VSS) LED99.3(VSS) LED100.3(VSS) LED101.3(VSS) LED102.3(VSS) LED103.3(VSS) LED104.3(VSS) LED105.3(VSS) LED106.3(VSS) LED107.3(VSS) LED108.3(VSS) LED109.3(VSS) LED110.3(VSS) LED111.3(VSS) LED112.3(VSS) LED113.3(VSS) LED114.3(VSS) LED115.3(VSS) LED116.1(-) M1.1(GND) QBOOT.4 QU1.19(TESTEN) QU1.57(GND) QU2.4(GND) QX1.2(GND) QX1.4(GND) R1.2 R5.1 RPRST.4 RPSWD.4 RPUSB.4 U1.3(GND) U2.1(GND) U3.4(GND)
VCC: C3.1 C6.2 C9.1 C10.2 C125.2 C126.2 C127.2 C128.2 C129.2 C130.1 C131.2 C132.2 C133.2 H21.2 M1.8(VCC) QU1.1(IOVDD) QU1.10(IOVDD) QU1.22(IOVDD) QU1.33(IOVDD) QU1.42(IOVDD) QU1.43(ADC_AVDD) QU1.44(VREG_IN) QU1.48(USB_VDD) QU1.49(IOVDD) QU2.8(VCC) R2.2 R3.1 R4.1 R12.1 RPSWD.1 U1.1(VCC) U2.2(Out) U3.8(VCC)
ADC0: QU1.38(GPIO26_ADC0) ; port ADC0
ADC1: QU1.39(GPIO27_ADC1) ; port ADC1
ADC2: QU1.40(GPIO28_ADC2) ; port ADC2
ADC3: QU1.41(GPIO29_ADC3) ; port ADC3
GPIO 0: 1.GP0 M1.7(GPIO3/RX) QU1.2(GPIO0) ; port GPIO 0
GPIO 1: 1.GP1 M1.2(GPIO1/TX) QU1.3(GPIO1) ; port GPIO 1
GPIO 2: 1.GP2 H22.2 QU1.4(GPIO2) R3.2 U1.4(SDA) U3.5(SDA) ; port GPIO 2
GPIO 3: 1.GP3 H22.3 QU1.5(GPIO3) R4.2 U1.6(SCL) U3.6(SCL) ; port GPIO 3
GPIO 4: QU1.6(GPIO4) ; port GPIO 4
GPIO 5: QU1.7(GPIO5) ; port GPIO 5
GPIO 6: QU1.8(GPIO6) ; port GPIO 6
GPIO 7: QU1.9(GPIO7) ; port GPIO 7
GPIO 8: QU1.11(GPIO8) ; port GPIO 8
GPIO 9: QU1.12(GPIO9) ; port GPIO 9
GPIO 10: QU1.13(GPIO10) ; port GPIO 10
GPIO 11: QU1.14(GPIO11) ; port GPIO 11
GPIO 12: QU1.15(GPIO12) ; port GPIO 12
GPIO 13: QU1.16(GPIO13) ; port GPIO 13
GPIO 14: QU1.17(GPIO14) ; port GPIO 14
GPIO 15: QU1.18(GPIO15) ; port GPIO 15
GPIO 16: 1.GP16 JP7.1 QU1.27(GPIO16) ; port GPIO 16
GPIO 17: QU1.28(GPIO17) ; port GPIO 17
GPIO 18: QU1.29(GPIO18) ; port GPIO 18
GPIO 19: QU1.30(GPIO19) ; port GPIO 19
GPIO 20: QU1.31(GPIO20) ; port GPIO 20
GPIO 21: QU1.32(GPIO21) ; port GPIO 21
GPIO 22: 1.GP22 JP6.1 QU1.34(GPIO22) ; port GPIO 22
GPIO 23: QU1.35(GPIO23) ; port GPIO 23
GPIO 24: QU1.36(GPIO24) ; port GPIO 24
GPIO 25: QU1.37(GPIO25) R13.1 ; port GPIO 25
QSPI_CLK: QU1.52(QSPI_SCLK) QU2.6(CLK) ; port QSPI_CLK
QSPI_SD0: QU1.53(QSPI_SD0) QU2.5(DI(IO0)) ; port QSPI_SD0
QSPI_SD1: QU1.55(QSPI_SD1) QU2.2(DO(IO1)) ; port QSPI_SD1
QSPI_SD2: QU1.54(QSPI_SD2) QU2.3(WP#(IO2)) ; port QSPI_SD2
QSPI_SD3: QU1.51(QSPI_SD3) QU2.7(HOLD#_or_RESET#(IO3)) ; port QSPI_SD3
QSPI_SS: QU1.56(QSPI_SS) QU2.1(CS#) R11.1 R12.2 ; port QSPI_SS
RUN: QU1.26(RUN) RPRST.2 ; port RUN
SWCLK: QU1.24(SWCLK) RPSWD.3 ; port SWCLK
SWD: QU1.25(SWD) RPSWD.2 ; port SWD
USB_D+: R7.2 RPUSB.3 ; port USB_D+
USB_D-: R9.2 RPUSB.2 ; port USB_D-
XIN: QU1.20(XIN) QX1.1(OSC1) ; port XIN
XOUT: QU1.21(XOUT) QX1.3(OSC2) ; port XOUT
NetBT1_1: BT1.1 U3.3(VBAT)
NetC4_1: C4.1 D1.1(C) JP4.2 LED2.1(VDD)
NetC7_1: C7.1 R2.1 U1.5(DVI)
NetESPRST_2: ESPRST.2 M1.6(RST)
NetH1_2: H1.2 H5.2 LED4.2(DOUT) LED25.4(DIN)
NetH2_2: H2.2 LED8.4(DIN) LED115.2(DOUT)
NetH3_2: H3.2 LED3.2(DOUT) LED114.4(DIN)
NetH4_2: H4.2 LED22.4(DIN) LED114.2(DOUT)
NetH6_2: H6.2 H8.2 LED34.2(DOUT) LED44.4(DIN)
NetH7_2: H7.2 H9.2 LED35.2(DOUT) LED47.4(DIN)
NetH10_2: H10.2 H12.2 LED56.2(DOUT) LED66.4(DIN)
NetH11_2: H11.2 H13.2 LED57.2(DOUT) LED69.4(DIN)
NetH14_2: H14.2 H16.2 LED78.2(DOUT) LED88.4(DIN)
NetH15_2: H15.2 H17.2 LED79.2(DOUT) LED91.4(DIN)
NetH18_2: H18.2 LED100.2(DOUT) LED113.4(DIN)
NetH19_2: H19.2 LED101.2(DOUT) LED112.4(DIN)
NetH20_2: H20.2 LED110.4(DIN) LED113.2(DOUT)
NetH23_1: H23.1 JP3.1 LED115.4(DIN)
NetH23_2: H23.2 JP2.1 JP3.2 LED2.2(DOUT)
NetH24_2: H24.2 JP6.2 JP7.2 R10.1
NetJP1_1: JP1.1 Q2.2(E) R10.2
NetJP1_2: JP1.2 JP2.2 JP5.2 LED2.4(DIN)
NetJP5_1: JP5.1 Q2.3(C) R8.1
NetLED1_2: LED1.2(DOUT) LED3.4(DIN)
NetLED1_4: LED1.4(DIN) LED16.2(DOUT)
NetLED4_4: LED4.4(DIN) LED23.2(DOUT)
NetLED5_2: LED5.2(DOUT) LED23.4(DIN)
NetLED5_4: LED5.4(DIN) LED17.2(DOUT)
NetLED6_2: LED6.2(DOUT) LED7.4(DIN)
NetLED6_4: LED6.4(DIN) LED18.2(DOUT)
NetLED7_2: LED7.2(DOUT) LED17.4(DIN)
NetLED8_2: LED8.2(DOUT) LED9.4(DIN)
NetLED9_2: LED9.2(DOUT) LED10.4(DIN)
NetLED10_2: LED10.2(DOUT) LED11.4(DIN)
NetLED11_2: LED11.2(DOUT) LED12.4(DIN)
NetLED12_2: LED12.2(DOUT) LED15.4(DIN)
NetLED13_2: LED13.2(DOUT) LED16.4(DIN)
NetLED13_4: LED13.4(DIN) LED14.2(DOUT)
NetLED14_4: LED14.4(DIN) LED15.2(DOUT)
NetLED18_4: LED18.4(DIN) LED19.2(DOUT)
NetLED19_4: LED19.4(DIN) LED20.2(DOUT)
NetLED20_4: LED20.4(DIN) LED21.2(DOUT)
NetLED21_4: LED21.4(DIN) LED22.2(DOUT)
NetLED24_2: LED24.2(DOUT) LED34.4(DIN)
NetLED24_4: LED24.4(DIN) LED33.2(DOUT)
NetLED25_2: LED25.2(DOUT) LED26.4(DIN)
NetLED26_2: LED26.2(DOUT) LED27.4(DIN)
NetLED27_2: LED27.2(DOUT) LED28.4(DIN)
NetLED28_2: LED28.2(DOUT) LED29.4(DIN)
NetLED29_2: LED29.2(DOUT) LED32.4(DIN)
NetLED30_2: LED30.2(DOUT) LED33.4(DIN)
NetLED30_4: LED30.4(DIN) LED31.2(DOUT)
NetLED31_4: LED31.4(DIN) LED32.2(DOUT)
NetLED35_4: LED35.4(DIN) LED45.2(DOUT)
NetLED36_2: LED36.2(DOUT) LED45.4(DIN)
NetLED36_4: LED36.4(DIN) LED39.2(DOUT)
NetLED37_2: LED37.2(DOUT) LED38.4(DIN)
NetLED37_4: LED37.4(DIN) LED40.2(DOUT)
NetLED38_2: LED38.2(DOUT) LED39.4(DIN)
NetLED40_4: LED40.4(DIN) LED41.2(DOUT)
NetLED41_4: LED41.4(DIN) LED42.2(DOUT)
NetLED42_4: LED42.4(DIN) LED43.2(DOUT)
NetLED43_4: LED43.4(DIN) LED44.2(DOUT)
NetLED46_2: LED46.2(DOUT) LED56.4(DIN)
NetLED46_4: LED46.4(DIN) LED55.2(DOUT)
NetLED47_2: LED47.2(DOUT) LED48.4(DIN)
NetLED48_2: LED48.2(DOUT) LED49.4(DIN)
NetLED49_2: LED49.2(DOUT) LED50.4(DIN)
NetLED50_2: LED50.2(DOUT) LED51.4(DIN)
NetLED51_2: LED51.2(DOUT) LED54.4(DIN)
NetLED52_2: LED52.2(DOUT) LED55.4(DIN)
NetLED52_4: LED52.4(DIN) LED53.2(DOUT)
NetLED53_4: LED53.4(DIN) LED54.2(DOUT)
NetLED57_4: LED57.4(DIN) LED67.2(DOUT)
NetLED58_2: LED58.2(DOUT) LED67.4(DIN)
NetLED58_4: LED58.4(DIN) LED61.2(DOUT)
NetLED59_2: LED59.2(DOUT) LED60.4(DIN)
NetLED59_4: LED59.4(DIN) LED62.2(DOUT)
NetLED60_2: LED60.2(DOUT) LED61.4(DIN)
NetLED62_4: LED62.4(DIN) LED63.2(DOUT)
NetLED63_4: LED63.4(DIN) LED64.2(DOUT)
NetLED64_4: LED64.4(DIN) LED65.2(DOUT)
NetLED65_4: LED65.4(DIN) LED66.2(DOUT)
NetLED68_2: LED68.2(DOUT) LED78.4(DIN)
NetLED68_4: LED68.4(DIN) LED77.2(DOUT)
NetLED69_2: LED69.2(DOUT) LED70.4(DIN)
NetLED70_2: LED70.2(DOUT) LED71.4(DIN)
NetLED71_2: LED71.2(DOUT) LED72.4(DIN)
NetLED72_2: LED72.2(DOUT) LED73.4(DIN)
NetLED73_2: LED73.2(DOUT) LED76.4(DIN)
NetLED74_2: LED74.2(DOUT) LED77.4(DIN)
NetLED74_4: LED74.4(DIN) LED75.2(DOUT)
NetLED75_4: LED75.4(DIN) LED76.2(DOUT)
NetLED79_4: LED79.4(DIN) LED89.2(DOUT)
NetLED80_2: LED80.2(DOUT) LED89.4(DIN)
NetLED80_4: LED80.4(DIN) LED83.2(DOUT)
NetLED81_2: LED81.2(DOUT) LED82.4(DIN)
NetLED81_4: LED81.4(DIN) LED84.2(DOUT)
NetLED82_2: LED82.2(DOUT) LED83.4(DIN)
NetLED84_4: LED84.4(DIN) LED85.2(DOUT)
NetLED85_4: LED85.4(DIN) LED86.2(DOUT)
NetLED86_4: LED86.4(DIN) LED87.2(DOUT)
NetLED87_4: LED87.4(DIN) LED88.2(DOUT)
NetLED90_2: LED90.2(DOUT) LED100.4(DIN)
NetLED90_4: LED90.4(DIN) LED99.2(DOUT)
NetLED91_2: LED91.2(DOUT) LED92.4(DIN)
NetLED92_2: LED92.2(DOUT) LED93.4(DIN)
NetLED93_2: LED93.2(DOUT) LED94.4(DIN)
NetLED94_2: LED94.2(DOUT) LED95.4(DIN)
NetLED95_2: LED95.2(DOUT) LED98.4(DIN)
NetLED96_2: LED96.2(DOUT) LED99.4(DIN)
NetLED96_4: LED96.4(DIN) LED97.2(DOUT)
NetLED97_4: LED97.4(DIN) LED98.2(DOUT)
NetLED101_4: LED101.4(DIN) LED111.2(DOUT)
NetLED102_2: LED102.2(DOUT) LED111.4(DIN)
NetLED102_4: LED102.4(DIN) LED105.2(DOUT)
NetLED103_2: LED103.2(DOUT) LED104.4(DIN)
NetLED103_4: LED103.4(DIN) LED106.2(DOUT)
NetLED104_2: LED104.2(DOUT) LED105.4(DIN)
NetLED106_4: LED106.4(DIN) LED107.2(DOUT)
NetLED107_4: LED107.4(DIN) LED108.2(DOUT)
NetLED108_4: LED108.4(DIN) LED109.2(DOUT)
NetLED109_4: LED109.4(DIN) LED110.2(DOUT)
NetLED116_2: LED116.2(+) R13.2
NetQ2_1: Q2.1(B) R5.2 R6.1
NetQBOOT_2: QBOOT.2 R11.2
NetQU1_46: QU1.46(USB_DM) R9.1
NetQU1_47: QU1.47(USB_DP) R7.1
NetR1_1: R1.1 U1.2(ADDR)
NetU3_1: U3.1(X1) X1.1(OSC1)
NetU3_2: U3.2(X2) X1.2(OSC2)

Not connected (* = marked no-connect by the designer): 1 3V3(OUT) 3V3_EN ADC_VREF GND3 GND6 GND7 GND8 GP4 GP5 GP6 GP7 GP8 GP9 GP10 GP11 GP12 GP13 GP14 GP15 GP17 GP18 GP19 GP20 GP21 GP26 GP27 GP28 RUN SWCLK SWDIO VSYS; ESPRST 1 3; LED112 2(DOUT); M1 3(GPIO2) 4(CH_PD) 5(GPIO0); QBOOT 1 3; QU2 9(EP); RPRST 1 3; U1 7(EP); U2 4(TAB); U3 7(SQW/OUT)

## Notes on the sheet
- (in symbol 1kΩ) R0805
- (in symbol 4.7K) R0805
- (in symbol 24Ω) R0805
- (in symbol 100Ω) R0805
- (in symbol BH1750FVI-TR) WSOF-6_L2.6-W1.6-P0.50-TL-EP
- (in symbol BS-6-1) BAT-SMD_BS-6-1
- (in symbol CD4148WP) D1206-RD
- (in symbol CFV206-60.003KDZF) OSC-TH_BD2.0-P0.70-D0.3
- (in symbol DS1307M/TR) SOP-8_L4.9-W3.9-P1.27-LS6.0-BL
- (in symbol FC-2012HRK-620D) LED0805-RD_RED
- (in symbol Header-Male-2.54_1x3) HDR-TH_3P-P2.54-V-M-1
- (in symbol JUMPER-SMT_2) JUMPERS_SMT-JUMPER_2_NC_PASTE_NO-SILK
- (in symbol LBC817-40LT1G) SOT-23-3_L2.9-W1.3-P1.90-LS2.4-BR
- (in symbol RASPBERRYPI-PICO) Raspberry Pi Pico; RASPBERRYPIPICO
- (in symbol RP2040) Raspberry Pi

## Library data of the parts
1 = RASPBERRYPI-PICO: BOM_Manufacturer Part: RASPBERRY PI PICO; BOM_Manufacturer: Raspberry-PI; Contributor: iylee; Package Display: Yes; BOM_Supplier: Element14; BOM_Supplier Part: 3643332; link: https://se.farnell.com/b/raspberry-pi; spicePre: ?; spiceSymbolName: RASPBERRYPI-PICO
BT1 = BS-6-1: BOM_Manufacturer: Q&J; Contributor: LCSC; Package Display: Yes; BOM_Supplier: LCSC; BOM_Supplier Part: C969909; BOM_Manufacturer Part: BS-6-1; BOM_JLCPCB Part Class: Extended Part; spicePre: B; spiceSymbolName: BS-6-1
C1-C7 C10-C133 = 100nF: BOM_Manufacturer Part: CC0805KRX7R9BB104; BOM_Manufacturer: YAGEO; nameAlias: Capacitance; SMT Type: Basic; BOM_Supplier: LCSC; BOM_LCSC Assembly: Yes; BOM_Supplier Part: C49678; spicePre: C; spiceSymbolName: CC0805KRX7R9BB104
C8 C9 = 100uF: BOM_Manufacturer: AVX; BOM_Manufacturer Part: TAJB107K006RNJ; nameAlias: Capacitance; SMT Type: Basic; BOM_Supplier: LCSC; BOM_LCSC Assembly: Yes; BOM_Supplier Part: C16133; spicePre: C; spiceSymbolName: TAJB107K006RNJ
D1 = CD4148WP: BOM_Manufacturer: LIZ; Package Display: Yes; BOM_Supplier: LCSC; BOM_Manufacturer Part: CD4148WP; BOM_Supplier Part: C109000; BOM_JLCPCB Part Class: Extended Part; spicePre: D; spiceSymbolName: CD4148WP
ESPRST QBOOT RPRST = PTS810SJM250SMTRLFS: BOM_Manufacturer: C&K; Contributor: LCSC; BOM_Supplier: LCSC; BOM_Supplier Part: C116501; BOM_Manufacturer Part: PTS810SJM250SMTRLFS; BOM_JLCPCB Part Class: Extended Part; spicePre: S; spiceSymbolName: PTS810SJM250SMTRLFS
H1-H24 = Header-Male-2.54_1x3: BOM_Manufacturer: BOOMELE; BOM_Manufacturer Part: Header2.54mm 1*3P; Package Display: Yes; BOM_Supplier: LCSC; BOM_Supplier Part: C49257; BOM_JLCPCB Part Class: Extended Part; spicePre: H; spiceSymbolName: Header-Male-2.54_1x3
JP1 JP3 JP6 JP7 = JUMPER-SMT_2: Contributor: Celeron; Package Display: No; spicePre: J; spiceSymbolName: JUMPER-SMT_2
JP2 JP4 JP5 = JUMPER-SMT_2: Contributor: Celeron; Package Display: Yes; spicePre: J; spiceSymbolName: JUMPER-SMT_2
LED1-LED115 = WS2812B-B: BOM_Manufacturer: Worldsemi; Contributor: LCSC; BOM_Supplier: LCSC; BOM_Manufacturer Part: WS2812B-B; BOM_Supplier Part: C114586; spicePre: L
LED116 = FC-2012HRK-620D: BOM_Manufacturer: NATIONSTAR; Package Display: Yes; BOM_Supplier: LCSC; BOM_Manufacturer Part: FC-2012HRK-620D; BOM_Supplier Part: C84256; BOM_JLCPCB Part Class: Basic Part; spicePre: L; spiceSymbolName: FC-2012HRK-620D
M1 = ESP-01: Contributor: DForest; Package Display: Yes; spicePre: M; spiceSymbolName: ESP-01
Q2 = LBC817-40LT1G: BOM_Manufacturer: LRC; Package Display: Yes; BOM_Supplier: LCSC; BOM_Manufacturer Part: LBC817-40LT1G; BOM_Supplier Part: C12767; BOM_JLCPCB Part Class: Extended Part; spicePre: Q; spiceSymbolName: LBC817-40LT1G
QU1 = RP2040: BOM_Manufacturer: Raspberry Pi(树莓派); Contributor: LCSC; BOM_Supplier: LCSC; BOM_Supplier Part: C2040; BOM_Manufacturer Part: RP2040; BOM_JLCPCB Part Class: Extended Part; spicePre: U; spiceSymbolName: RP2040
QU2 = W25Q128JWPIQ: BOM_Manufacturer: WINBOND(华邦); Contributor: LCSC; BOM_Supplier: LCSC; BOM_Supplier Part: C2689660; BOM_Manufacturer Part: W25Q128JWPIQ; BOM_JLCPCB Part Class: Extended Part; spicePre: U; spiceSymbolName: W25Q128JWPIQ
QX1 = 12MHz: BOM_Manufacturer: YXC; BOM_Manufacturer Part: X322512MSB4SI; nameAlias: Frequency; Contributor: LCSC; BOM_Supplier: LCSC; BOM_Supplier Part: C9002; BOM_JLCPCB Part Class: Basic Part; spicePre: X; spiceSymbolName: SMD-3225_4P12M12PF10PPM
R1 R3 R4 = 4.7K: BOM_Manufacturer: UniOhm; BOM_Manufacturer Part: 0805W8F4701T5E; nameAlias: Resistance (Ohms); Contributor: LCSC; Package Display: Yes; BOM_Supplier: LCSC; BOM_Supplier Part: C17673; BOM_JLCPCB Part Class: Basic Part; spicePre: R; spiceSymbolName: CR0805F4K7P05
R2 = 1kΩ: BOM_Manufacturer: UniOhm; BOM_Manufacturer Part: 0805W8F1001T5E; Resistance (Ohms): 1K; nameAlias: Resistance; Contributor: LCSC; Package Display: Yes; BOM_Supplier: LCSC; BOM_Supplier Part: C17513; BOM_JLCPCB Part Class: Basic Part; spicePre: R; spiceSymbolName: PTFR0805D1K00P9
R5 = 10K: BOM_Manufacturer: UniOhm; BOM_Manufacturer Part: 0805W8F1002T5E; nameAlias: Resistance (Ohms); SMT Type: Basic; BOM_Supplier: LCSC; BOM_LCSC Assembly: Yes; BOM_Supplier Part: C17414; spicePre: R; spiceSymbolName: 0805W8F1002T5E
R6 = 22K: BOM_Manufacturer: UniOhm; BOM_Manufacturer Part: 0805W8F2202T5E; nameAlias: Resistance (Ohms); SMT Type: Basic; BOM_Supplier: LCSC; BOM_LCSC Assembly: Yes; BOM_Supplier Part: C17560; spicePre: R; spiceSymbolName: 0805W8F1002T5E
R7 R9 = 24Ω: BOM_Manufacturer: Ever Ohms Tech; BOM_Manufacturer Part: CR0805F24RP05; Resistance (Ohms): 24; nameAlias: Resistance; Contributor: LCSC; Package Display: Yes; BOM_Supplier: LCSC; BOM_Supplier Part: C429050; BOM_JLCPCB Part Class: Extended Part; spicePre: R; spiceSymbolName: CR0805F24RP05
R8 R11 R12 = 1K: BOM_Manufacturer: UniOhm; BOM_Manufacturer Part: 0805W8F1001T5E; nameAlias: Resistance (Ohms); SMT Type: Basic; BOM_Supplier: LCSC; BOM_LCSC Assembly: Yes; BOM_Supplier Part: C17513; spicePre: R; spiceSymbolName: 0805W8F1002T5E
R10 = 50: BOM_Manufacturer: UniOhm; BOM_Manufacturer Part: 0805W8F1002T5E; nameAlias: Resistance (Ohms); SMT Type: Basic; BOM_Supplier: LCSC; BOM_LCSC Assembly: Yes; BOM_Supplier Part: C17414; spicePre: R; spiceSymbolName: 0805W8F1002T5E
R13 = 100Ω: BOM_Manufacturer: UniOhm; BOM_Manufacturer Part: 0805W8F1000T5E; Resistance (Ohms): 100; nameAlias: Resistance; Contributor: LCSC; Package Display: Yes; BOM_Supplier: LCSC; BOM_Supplier Part: C17408; BOM_JLCPCB Part Class: Extended Part; spicePre: R; spiceSymbolName: PTFR0805B100RN9
RPSWD RPUSB = HDR-M-2.54_1x4: Contributor: LCEDA_Lib; BOM_Supplier Part: C124378; BOM_Supplier: LCSC; spicePre: J; spiceSymbolName: HDR-M-2.54_1x4
U1 = BH1750FVI-TR: BOM_Manufacturer: ROHM; Package Display: Yes; BOM_Supplier: LCSC; BOM_Manufacturer Part: BH1750FVI-TR; BOM_Supplier Part: C78960; BOM_JLCPCB Part Class: Extended Part; spicePre: U; spiceSymbolName: BH1750FVI-TR
U2 = AMS1117-3.3: BOM_Manufacturer: AMS; sourceId: dwIGgezVh; SMT Type: Basic; timeStamp: 1476261164; BOM_Supplier: LCSC; BOM_Manufacturer Part: AMS1117-3.3; BOM_LCSC Assembly: Yes; image: //image.lceda.cn/szlcsc/C6186.jpg; BOM_Supplier Part: C6186; spicePre: U
U3 = DS1307M/TR: BOM_Manufacturer: HGSEMI; Contributor: LCSC; Package Display: Yes; BOM_Supplier: LCSC; BOM_Supplier Part: C356706; BOM_Manufacturer Part: DS1307M/TR; BOM_JLCPCB Part Class: Extended Part; spicePre: U; spiceSymbolName: DS1307M/TR
X1 = CFV206-60.003KDZF: BOM_Manufacturer: CITIZEN; Contributor: LCSC; Package Display: Yes; BOM_Supplier: LCSC; BOM_Supplier Part: C389957; BOM_Manufacturer Part: CFV206-60.003KDZF; BOM_JLCPCB Part Class: Extended Part; spicePre: X; spiceSymbolName: CFV206-60.003KDZF